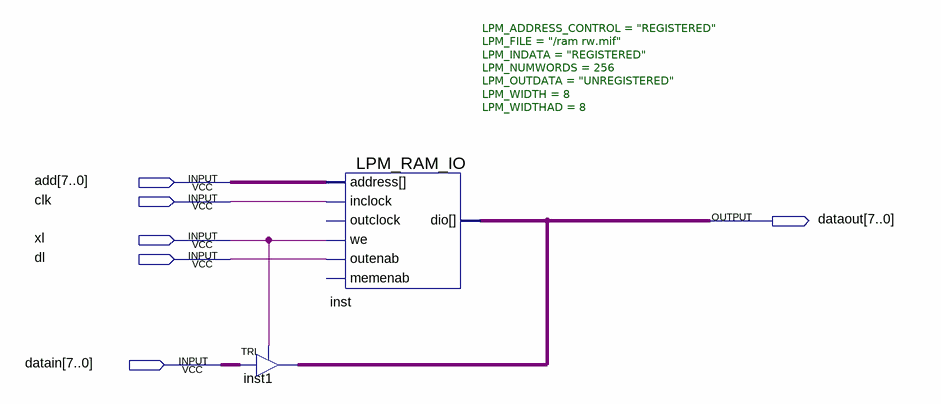
[diagram p0: schematic sheet]
// Quartus schematic lpm_ram_10.bdf as structural Verilog: 2 symbols, 6 pins
module lpm_ram_10 (
  input  [7:0] add,
  input  clk,
  input  xl,
  input  dl,
  input  [7:0] datain,
  output [7:0] dataout
);

  TRI inst1[7:0] (.IN(datain), .OE(xl), .OUT(dataout));
  LPM_RAM_IO #(.LPM_ADDRESS_CONTROL("REGISTERED"), .LPM_FILE("/ram rw.mif"), .LPM_INDATA("REGISTERED"), .LPM_NUMWORDS(256), .LPM_OUTDATA("UNREGISTERED"), .LPM_WIDTH(8), .LPM_WIDTHAD(8)) inst (
    .address(add), .inclock(clk), .we(xl), .outenab(dl), .dio(dataout));  // open: outclock, memenab
endmodule
